# EAGLE schematic MSPM0G3107 (EAGLE 9.7.0)
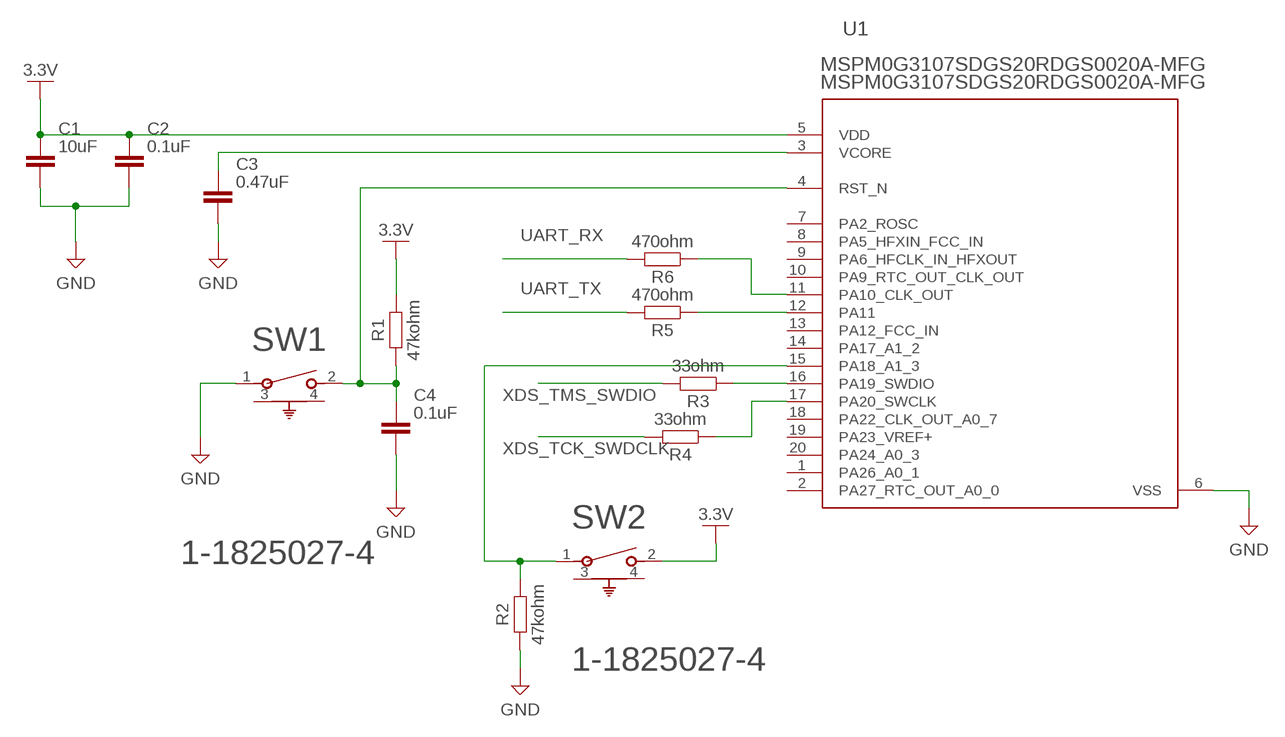
[diagram p0: schematic, sheet 1]

## Parts
C1  10uF  C_CHIP-0805(2012-METRIC)  [CAPC2012X110]
C2  0.1uF  C_CHIP-0805(2012-METRIC)  [CAPC2012X110]
C3  0.47uF  C_CHIP-0805(2012-METRIC)  [CAPC2012X110]
C4  0.1uF  C_CHIP-0805(2012-METRIC)  [CAPC2012X110]
R1  47kohm  R_CHIP-0603(1608-METRIC)  [RESC1608X60]
R2  47kohm  R_CHIP-0603(1608-METRIC)  [RESC1608X60]
R3  33ohm  R_CHIP-0603(1608-METRIC)  [RESC1608X60]
R4  33ohm  R_CHIP-0603(1608-METRIC)  [RESC1608X60]
R5  470ohm  R_CHIP-0603(1608-METRIC)  [RESC1608X60]
R6  470ohm  R_CHIP-0603(1608-METRIC)  [RESC1608X60]
SW1  1-1825027-4  [SW2_1825027-E]
SW2  1-1825027-4  [SW2_1825027-E]
U1  MSPM0G3107SDGS20RDGS0020A-MFG  [DGS0020A-MFG]

## Nets
3.3V: C1.1 C2.1 R1.2 SW2.2 U1.5(VDD)
GND: C1.2 C2.2 C3.2 C4.2 R2.1 SW1.1 U1.6(VSS)
N$1: C3.1 U1.3(VCORE)
N$2: C4.1 R1.1 SW1.2 U1.4(RST_N)
N$3: R3.1 U1.16(PA19_SWDIO)
N$4: R2.2 SW2.1 U1.15(PA18_A1_3)
N$5: R4.1 U1.17(PA20_SWCLK)
N$6: R5.1 U1.12(PA11)
N$7: R6.1 U1.11(PA10_CLK_OUT)
UART_RX: R6.2
UART_TX: R5.2
XDS_TCK_SWDCLK: R4.2
XDS_TMS_SWDIO: R3.2
Unconnected: SW1.3 SW1.4 SW2.3 SW2.4 U1.1(PA26_A0_1) U1.2(PA27_RTC_OUT_A0_0) U1.7(PA2_ROSC) U1.8(PA5_HFXIN_FCC_IN) U1.9(PA6_HFCLK_IN_HFXOUT) U1.10(PA9_RTC_OUT_CLK_OUT) U1.13(PA12_FCC_IN) U1.14(PA17_A1_2) U1.18(PA22_CLK_OUT_A0_7) U1.19(PA23_VREF+) U1.20(PA24_A0_3)

## Library data of the parts
C1-C4 = Capacitor:C: Capacitor - Generic; CATEGORY: Capacitor; PACKAGE_SIZE: 0805; PACKAGE_TYPE: SMD; SUBCATEGORY: Ceramic Capacitors; TYPE: MLCC
R1-R6 = Resistor:R: Resistor Fixed - Generic; CATEGORY: Resistors; DESCRIPTION: Chip Resistor 1.60 X 0.82 X 0.60 mm body 0603(1608-METRIC) Package; PACKAGE_SIZE: 0603; PACKAGE_TYPE: SMD
SW1 SW2 = Switches:1-1825027-4; BUILT_BY: EMA_UL_Team; CATEGORY: Tactile Switches; CONFIGURATION__POLE-THROW_: Single Pole - Single Throw; CONTACT_CURRENT_RATING: 50; COPYRIGHT: Copyright (C) 2016 Accelerated Designs. All rights reserved; DESCRIPTION: FSMRA5JH04=R/A,TACT PB SW,160G; MANUFACTURER_PART_NUMBER: 1-1825027-4; MAX_SWITCHING_CURRENT: -; MAX_SWITCHING_VOLTAGE_AC_: -; PART_STATUS: active; PRODUCT_TYPE: Switch; SERIES: Unknown; SWITCH_TYPE: Tactile Switches; TE_INTERNAL_NUMBER: 1-1825027-4; TE_PART_NUMBER: 1-1825027-4; VENDOR: TE Connectivity; VOLTAGE_RATING: -
U1 = 2025-01-31_14-30-48_Library:MSPM0G3107SDGS20R; COPYRIGHT: Copyright (C) 2025 Ultra Librarian. All rights reserved.; MANUFACTURER_PART_NUMBER: MSPM0G3107SDGS20R; MFR_NAME: Texas Instruments; REFDES: RefDes; TYPE: TYPE